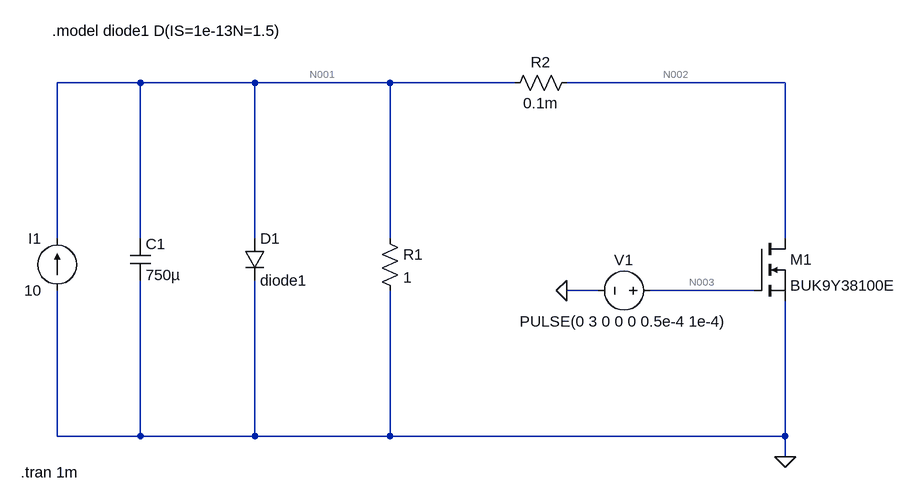
[diagram p0: schematic fetsim.asc]
fetsim.asc, the LTspice schematic file:
Version 4
SHEET 1 1300 680
WIRE 112 -128 -16 -128
WIRE 288 -128 112 -128
WIRE 496 -128 288 -128
WIRE 688 -128 496 -128
WIRE 1104 -128 768 -128
WIRE -16 112 -16 -128
WIRE 112 112 112 -128
WIRE 288 112 288 -128
WIRE 496 112 496 -128
WIRE 1104 112 1104 -128
WIRE 816 192 768 192
WIRE 1056 192 896 192
WIRE -16 416 -16 192
WIRE 112 416 112 176
WIRE 112 416 -16 416
WIRE 288 416 288 176
WIRE 288 416 112 416
WIRE 496 416 496 192
WIRE 496 416 288 416
WIRE 1104 416 1104 208
WIRE 1104 416 496 416
WIRE 1104 448 1104 416
FLAG 768 192 0
FLAG 1104 448 0
SYMBOL current -16 192 R180
WINDOW 0 24 80 Left 2
WINDOW 3 24 0 Left 2
WINDOW 123 0 0 Left 2
WINDOW 39 0 0 Left 2
SYMATTR InstName I1
SYMATTR Value 10
SYMBOL cap 96 112 R0
SYMATTR InstName C1
SYMATTR Value 750µ
SYMBOL diode 272 112 R0
SYMATTR InstName D1
SYMATTR Value diode1
SYMBOL res 480 96 R0
SYMATTR InstName R1
SYMATTR Value 1
SYMBOL nmos 1056 112 R0
SYMATTR InstName M1
SYMATTR Value BUK9Y38100E
SYMBOL voltage 912 192 R90
WINDOW 0 -32 56 VBottom 2
WINDOW 3 32 56 VTop 2
WINDOW 123 0 0 Left 2
WINDOW 39 0 0 Left 2
SYMATTR InstName V1
SYMATTR Value PULSE(0 3 0 0 0 0.5e-4 1e-4)
SYMBOL res 784 -144 R90
WINDOW 0 0 56 VBottom 2
WINDOW 3 32 56 VTop 2
SYMATTR InstName R2
SYMATTR Value 0.1m
TEXT -24 -208 Left 2 !.model diode1 D(IS=1e-13N=1.5)
TEXT -72 472 Left 2 !.tran 1m

The netlist it stands for:
* fetsim.asc
I1 0 N001 10
C1 N001 0 750µ
D1 N001 0 diode1
R1 N001 0 1
M1 N002 N003 0 0 BUK9Y38100E
V1 N003 0 PULSE(0 3 0 0 0 0.5e-4 1e-4)
R2 N002 N001 0.1m
.model D D
.lib standard.dio
.model NMOS NMOS
.model PMOS PMOS
.lib standard.mos
.model diode1 D(IS=1e-13N=1.5)
.tran 1m
.backanno
.end

* Results of the author's LTspice run, read from the files saved beside the schematic
* Operating Point, zero values left out:
*   V(n001) = 1.366 V
*   V(n002) = 1.366 V
*   Id(M1) = 1.931 pA
*   Is(M1) = -1.931 pA
*   I(D1) = 8.634 A
*   I(I1) = 10 A
*   I(R2) = -4.441 pA
*   I(R1) = 1.366 A
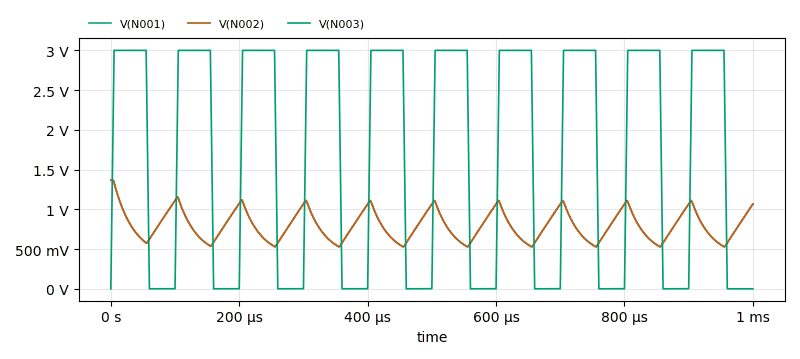
[diagram p1: Transient Analysis of fetsim.asc, plotted from the saved traces]
* Transient Analysis, 1 run:
*   V(N001): min 529 mV, max 1.366 V, average 793.8 mV, rms 814.4 mV, last 1.067 V
*   V(N002): min 528 mV, max 1.366 V, average 792.8 mV, rms 813.5 mV, last 1.067 V
*   V(N003): min 0 V, max 3 V, average 1.65 V, rms 2.192 V, last 0 V